# EasyEDA Pro project GPSclock.eprj

# Schematic gpsclock
Create Date: 2023-04-23; Page Name: P1; Project Name: GPSclock; Schematic Name: gpsclock; Update Date: 2023-05-05; Company: EasyEDA.com; Drawed: EasyEDA Pro; Page Size: A4; Part Number: JLCPCB-002; Reviewed: EasyEDA Pro; Version: V0.1
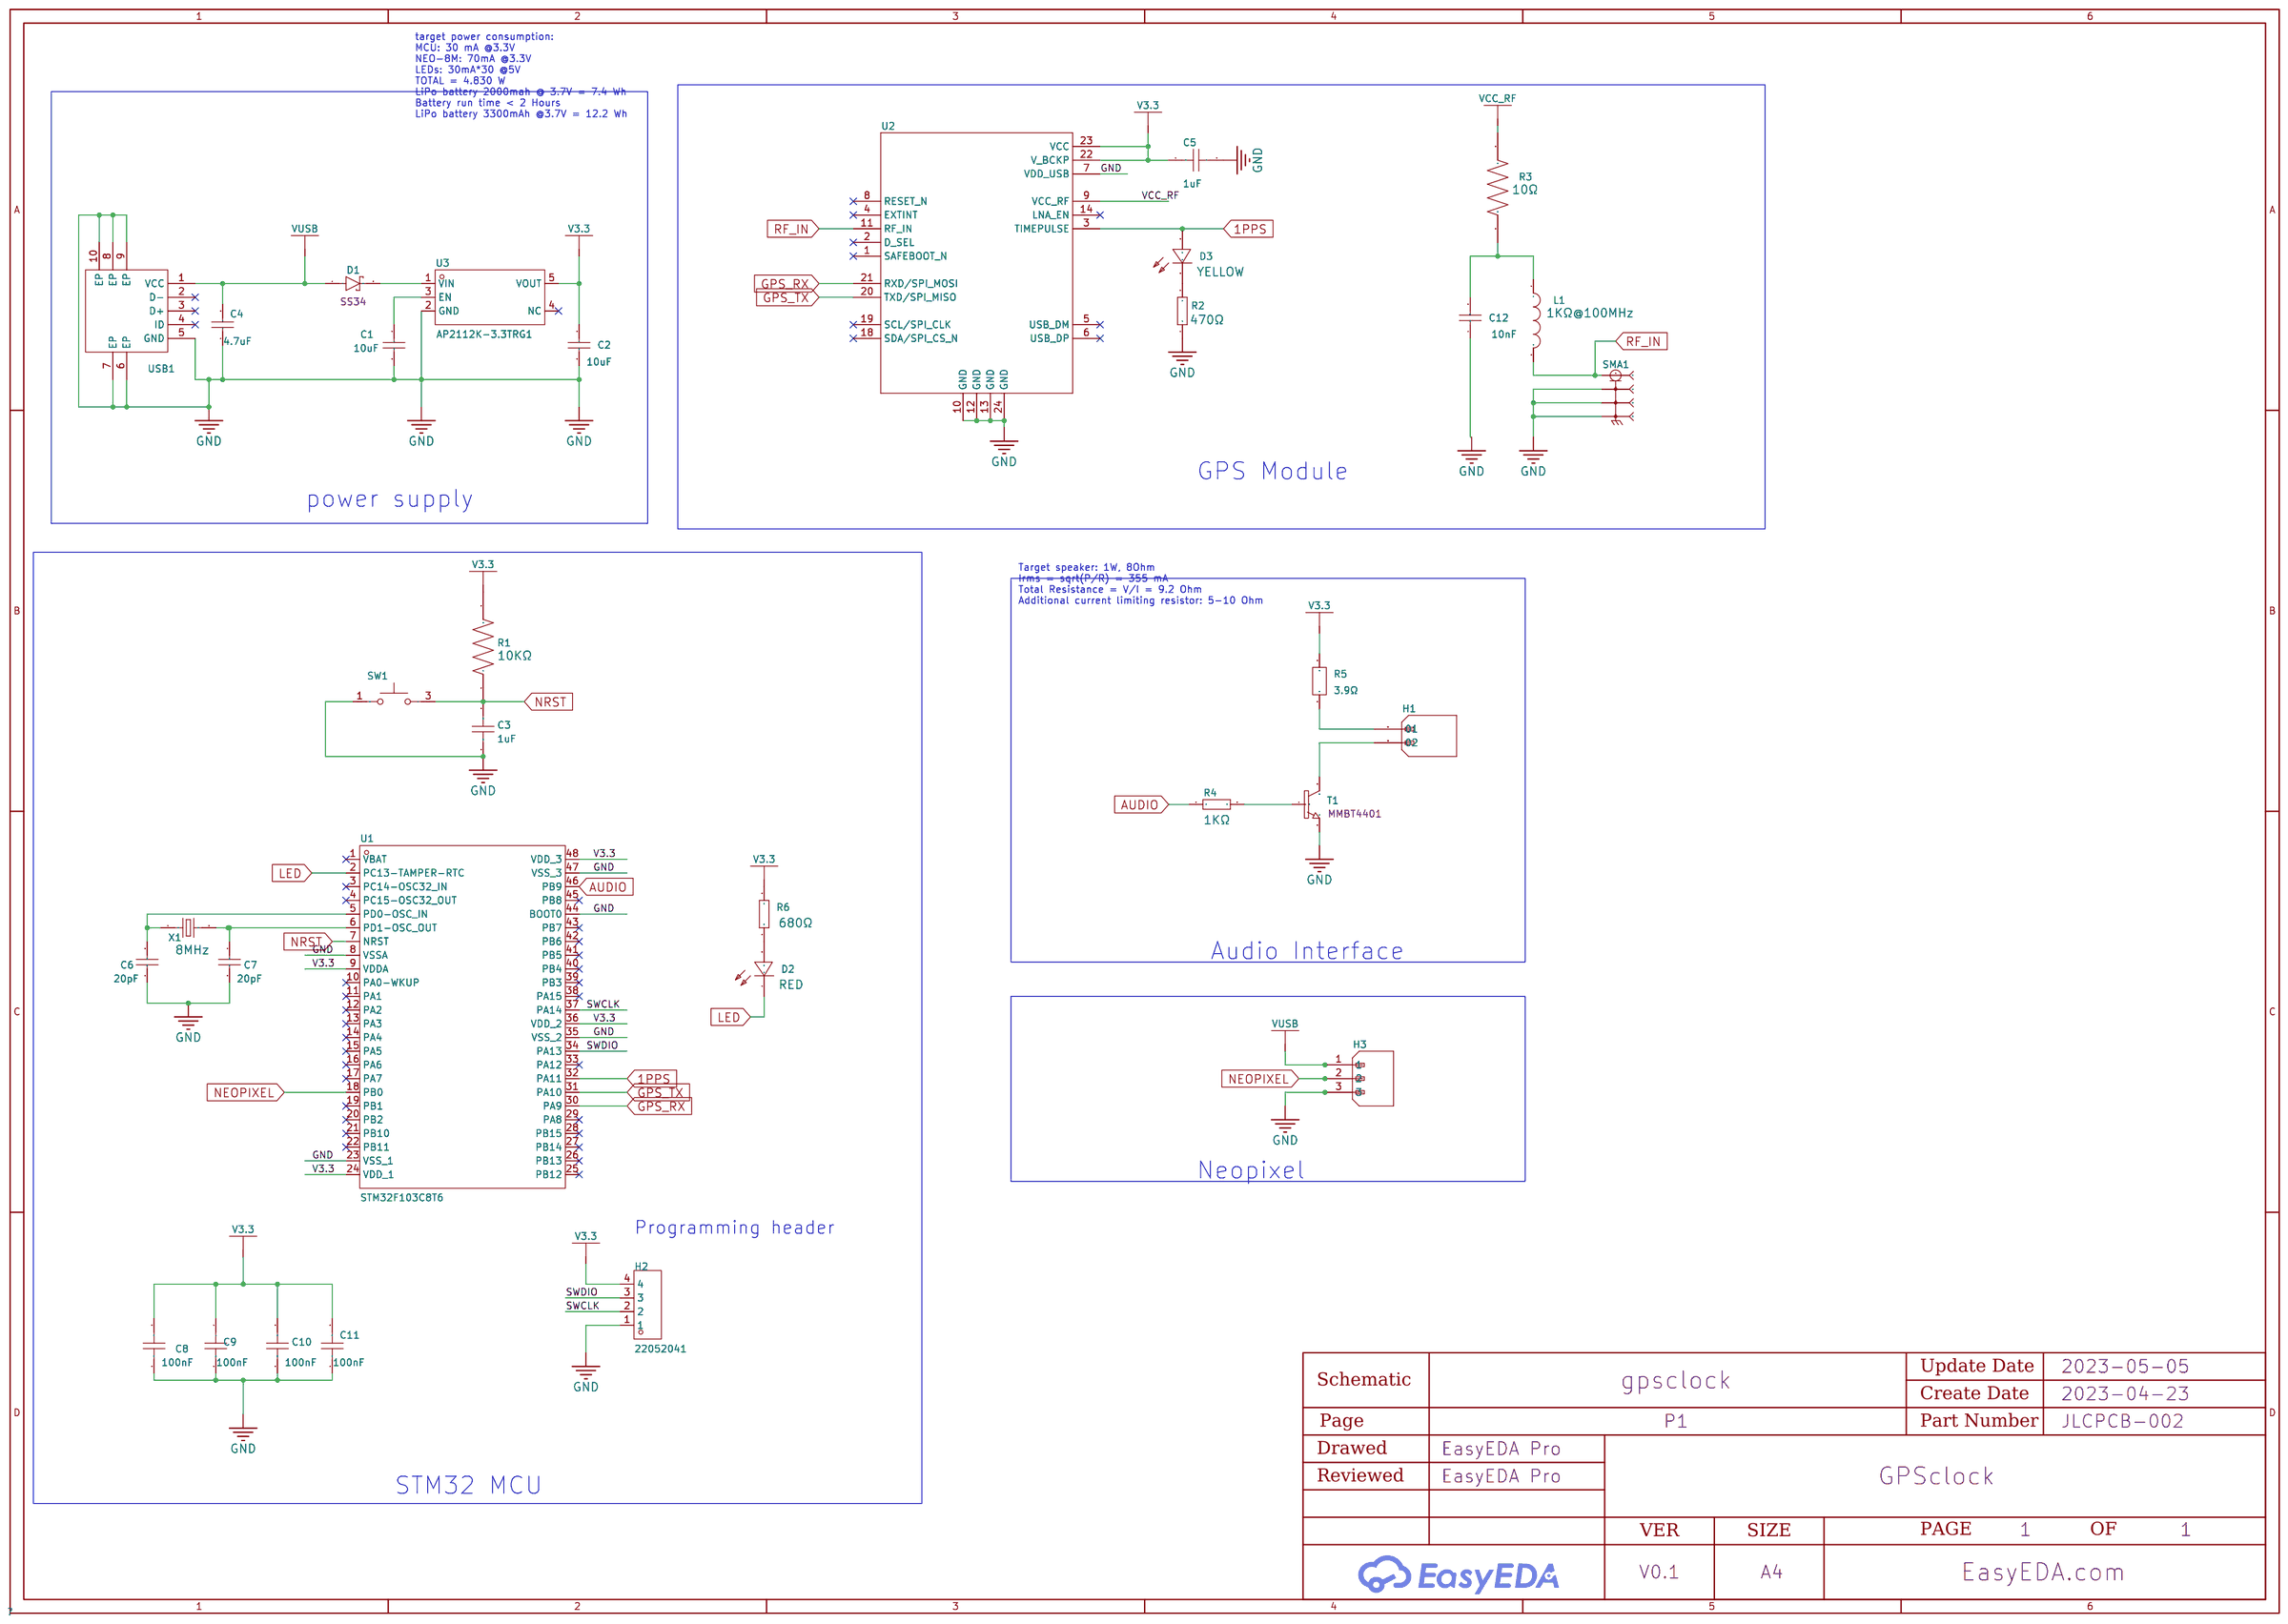
[diagram p0: schematic sheet]

## Parts
C1  10uF  [C1206]
C2  10uF  [C1206]
C3  1uF  [C1206]
C4  4.7uF  [C0603]
C5  1uF  [C1206]
C6  20pF  [C0603]
C7  20pF  [C0603]
C8  100nF  [C0603]
C9  100nF  [C0603]
C10  100nF  [C0603]
C11  100nF  [C0603]
C12  10nF  [C0805]
D1  -  [SODFL3718X102N]
D2  RED  [LED_APHD1608LVBC/D]
D3  YELLOW  [LED_APHD1608LVBC/D]
H1  -  [WURTH_61300211121]
H2  22052041  [HDR-TH_4P-P2.54-H-M-W9.5]
H3  -  [AMPHENOL_G800W305018EU]
L1  1KΩ@100MHz  [BEADC1005X55N]
R1  10KΩ  [RES_ERA8AEB103V]
R2  470Ω  [R0603_NEW]
R3  10Ω  [RESC2012X60N]
R4  1KΩ  [R0603_NEW]
R5  3.9Ω  [RES-TH_BD4.5-L11.5-P15.50-D0.8]
R6  680Ω  [R0603_NEW]
SMA1  -  [MOLEX_0734120110]
SW1  -  [SW_800SP9B6M6RE]
T1  -  [TRANS_MMBT4401]
U1  STM32F103C8T6  [LQFP-48_L7.0-W7.0-P0.50-LS9.0-BL]
U2  -  [XCVR_NEO-M8N-0]
U3  AP2112K-3.3TRG1  [SOT-25-5_L2.9-W1.6-P0.95-LS2.8-BL]
USB1  1050170001  [MICRO-USB-SMD_105017-0001]
X1  8MHz  [XTAL_ECS-80-18-5PX-TR]

## Library data of the parts
C1 C2 = CL31A106KBHNNNE: Capacitance: Tolerance:±10% Tolerance:±10% Voltage Rated: Temperature Coefficient:; LCSC Part Name: 10uF ±10% 50V; Supplier Part: C13585; Manufacturer: SAMSUNG(三星); Supplier Footprint: 1206; JLCPCB Part Class: Basic Part; Datasheet: https://atta.szlcsc.com/upload/public/pdf/source/20160103/1457707668742.pdf; Supplier: LCSC; Tolerance: ±10%
C3 C5 = CL31B105KBHNNNE: Capacitance: Tolerance:±10% Tolerance:±10% Voltage Rated: Temperature Coefficient:; LCSC Part Name: 1uF ±10% 50V; Supplier Part: C1848; Manufacturer: SAMSUNG(三星); Supplier Footprint: 1206; JLCPCB Part Class: Basic Part; Datasheet: https://atta.szlcsc.com/upload/public/pdf/source/20160103/1457707700211.pdf; Supplier: LCSC; Tolerance: ±10%
C4 = CL10A475KO8NNNC: Capacitance: Tolerance:±10% Tolerance:±10% Voltage Rated: Temperature Coefficient:; LCSC Part Name: 4.7uF ±10% 16V; Supplier Part: C19666; Manufacturer: SAMSUNG(三星); Supplier Footprint: 0603; JLCPCB Part Class: Basic Part; Datasheet: https://atta.szlcsc.com/upload/public/pdf/source/20160103/1457707703134.pdf; Supplier: LCSC; Tolerance: ±10%
C6 C7 = CL10C200JB8NNNC: Capacitance: Tolerance:±5% Tolerance:±5% Voltage Rated: Temperature Coefficient:; LCSC Part Name: 20pF ±5% 50V; Supplier Part: C1648; Manufacturer: SAMSUNG(三星); Supplier Footprint: 0603; JLCPCB Part Class: Basic Part; Datasheet: https://atta.szlcsc.com/upload/public/pdf/source/20160103/1457707686863.pdf; Supplier: LCSC; Tolerance: ±5%
C8-C11 = CC0603KRX7R9BB104: Capacitance: Tolerance:±10% Tolerance:±10% Voltage Rated: Temperature Coefficient:; LCSC Part Name: 100nF ±10% 50V; Supplier Part: C14663; Manufacturer: YAGEO(国巨); Supplier Footprint: 0603; JLCPCB Part Class: Basic Part; Datasheet: https://atta.szlcsc.com/upload/public/pdf/source/20180910/C282072_33301C7F631E79921B82A8DAC6BCC5B3.pdf; Supplier: LCSC; Tolerance: ±10%
C12 = CL21B103KBANNNC: Capacitance: Tolerance:±10% Tolerance:±10% Voltage Rated: Temperature Coefficient:; LCSC Part Name: 10nF ±10% 50V; Supplier Part: C1710; Manufacturer: SAMSUNG(三星); Supplier Footprint: 0805; JLCPCB Part Class: Basic Part; Datasheet: https://atta.szlcsc.com/upload/public/pdf/source/20160103/1457707693082.pdf; Supplier: LCSC; Tolerance: ±10%
D1 = SS34LWH_: SS34; Manufacturer: Taiwan Semiconductor Corporation; Manufacturer Part: SS34LWH
D2 = APTD1608LSURCK: Manufacturer: Kingbright
D3 = APTD1608LSYCK: Manufacturer: Kingbright
H1 = 61300211121_: Manufacturer: Würth Elektronik; Manufacturer Part: 61300211121
H2 = 22052041: Pitch:2.54mm Number of Pins:4 Number of Rows: Pin Structure:1x4P Row Spacing:- Mounting Type:Shrouded Circluar Pins/Square Pins:- Current Rating (Max):- Voltage Rating (Max):- Length of Mating Pin:3.15mm Insulation Height:3.3mm Length of End Connection Pi; LCSC Part Name: 2.54mm 1x4P 弯插; Supplier Part: C586987; Manufacturer: MOLEX; Supplier Footprint: 弯插,P=2.54mm; JLCPCB Part Class: Extended Part; Datasheet: https://atta.szlcsc.com/upload/public/pdf/source/20200716/C586991_D4DD4C3D7A2E61AF64D6B99FD6AF9B0B.pdf; Supplier: LCSC; Pitch: 2.54mm; Number of Pins: 4; Pin Structure: 1x4P; Mounting Type: Shrouded; Length of Mating Pin: 3.15mm; Insulation Height: 3.3mm
H3 = G800W305018EU_: Manufacturer: AMPHENOL; Manufacturer Part: G800W305018EU
L1 = BLM15HG102BH1D_: Manufacturer: Murata Electronics; Manufacturer Part: BLM15HG102BH1D
R1 = ERA8AEB103V_
R2 = RC0603FR-13470RL_: Manufacturer: YAGEO; Manufacturer Part: RC0603FR-13470RL
R3 = SR0805FR-4710RL_: Manufacturer: YAGEO; Manufacturer Part: SR0805FR-4710RL
R4 = RC0603FR-101KL_: Manufacturer: YAGEO; Manufacturer Part: RC0603FR-101KL
R5 = RSF100JR-73-3R9: Type:Metal Oxide Resistors Resistance: Tolerance:±5% Tolerance:±5% Power(Watts):1W Temperature Coefficient: Temperature Coefficient: Operating Temperature Range:-55℃~+235℃ Operating Temperature Range:-55℃~+235℃; LCSC Part Name: 3.9Ω ±5% 1W; Supplier Part: C1761372; Manufacturer: YAGEO(国巨); Supplier Footprint: 轴向引线,4.5x11.5mm; JLCPCB Part Class: Extended Part; Datasheet: https://atta.szlcsc.com/upload/public/pdf/source/20200722/C705062_59B157870D59CA0881ABA296A8644ADF.pdf; Supplier: LCSC; Type: Metal Oxide Resistors; Tolerance: ±5%; Power(Watts): 1W; Operating Temperature Range: -55℃~+235℃
R6 = RC0603FR-13680RL_: Manufacturer: YAGEO; Manufacturer Part: RC0603FR-13680RL
SMA1 = 0734120110_: Manufacturer: MOLEX; Manufacturer Part: 0734120110
SW1 = 800SP9B6M6RE_: Manufacturer: E-Switch; Manufacturer Part: 800SP9B6M6RE
T1 = MMBT4401_: MMBT4401; Manufacturer: ANBON SEMICONDUCTOR LIMITED; Manufacturer Part: 4530-MMBT4401CT-ND
U1 = STM32F103C8T6: CPU Core:ARM Cortex-M3 CPU Maximum Speed:72MHz Operating Voltage Range:2V~3.6V Operating Voltage Range:2V~3.6V Program Storage Size:64KB Program Memory Type:FLASH RAM Size:20KB EEPROM:64KB GPIO Ports Number:37 ADC (Bit):12bit DAC (Bit):- PWM (Bit):- Unive; LCSC Part Name: ARM Cortex-M3 72MHz MSL=3; Supplier Part: C8734; Manufacturer: ST(意法半导体); Supplier Footprint: LQFP-48(7x7); JLCPCB Part Class: Basic Part; Datasheet: https://atta.szlcsc.com/upload/public/pdf/source/20220812/8363ACEC51AD55ECEB84799464F7CB85.pdf; Supplier: LCSC; CPU Core: ARM Cortex-M3; CPU Maximum Speed: 72MHz; Operating Voltage Range: 2V~3.6V; Program Storage Size: 64KB; Program Memory Type: FLASH; RAM Size: 20KB; EEPROM: 64KB; GPIO Ports Number: 37; ADC (Bit): 12bit; Peripheral/Function: WDT；DMA；WDT；On-chip temperature sensor; Internal Oscillator: 有; Operating Temperature Range: -40℃~+85℃
U2 = NEO-M8N-0_: Manufacturer: U-BLOX; Manufacturer Part: NEO-M8N-0
U3 = AP2112K-3.3TRG1: Output Type: Output Polarity:Positive Number of Outputs:1 Maximum Input Voltage:6V Output Voltage:3.3V~3.3V Output Voltage:3.3V~3.3V Dropout Voltage:400mV@(600mA) Output Current:600mA Power Supply Rejection Ratio (PSRR):65dB@(100Hz,1kHz); Supplier Part: C51118; Manufacturer: DIODES(美台); Supplier Footprint: SOT-25-5; JLCPCB Part Class: Extended Part; Datasheet: https://atta.szlcsc.com/upload/public/pdf/source/20171221/C51118_15138312998391195590.pdf; Supplier: LCSC; Output Polarity: Positive; Number of Outputs: 1; Maximum Input Voltage: 6V; Output Voltage: 3.3V~3.3V; Dropout Voltage: 400mV@(600mA); Output Current: 600mA; Power Supply Rejection Ratio (PSRR): 65dB@(100Hz,1kHz)
USB1 = 1050170001: Connector Type:Micro-B Standard:USB 2.0 Gender:Female Number of Contacts:5 Number of Ports:1 Mounting Style:Surface Mount Current Rating - Power (Max):- Operating Temperature Range:- Operating Temperature Range:-; LCSC Part Name: Micro-B 母座 卧贴; Supplier Part: C136000; Manufacturer: MOLEX; Supplier Footprint: SMD; JLCPCB Part Class: Extended Part; Datasheet: https://atta.szlcsc.com/upload/public/pdf/source/20171113/C136000_15105610884381115465.pdf; Supplier: LCSC; Connector Type: Micro-B; Standard: USB 2.0; Gender: Female; Number of Contacts: 5; Number of Ports: 1; Mounting Style: Surface Mount
X1 = ECS-80-18-5PX-TR_: Manufacturer: ECS inc; Manufacturer Part: ECS-80-18-5PX-TR

## Nets
GND: C1.1 C2.1 C3.1 C4.1 C5.2 C6.1 C7.2 C8.1 C9.2 C10.1 C11.1 C12.1 H2.1 H3.3 R2.1 SMA1.2(GND) SMA1.3(GND) SMA1.4(GND) SW1.1 T1.2(E) U1.8(VSSA) U1.23(VSS_1) U1.35(VSS_2) U1.44(BOOT0) U1.47(VSS_3) U2.7(VDD_USB) U2.10(GND) U2.12(GND) U2.13(GND) U2.24(GND) U3.2(GND) USB1.5(GND) USB1.6(EP) USB1.7(EP) USB1.8(EP) USB1.9(EP) USB1.10(EP)
V3.3: C2.2 C5.1 C8.2 C9.1 C10.2 C11.2 H2.4 R1.2 R5.2 R6.2 U1.9(VDDA) U1.24(VDD_1) U1.36(VDD_2) U1.48(VDD_3) U2.22(V_BCKP) U2.23(VCC) U3.5(VOUT)
VCC_RF: R3.2 U2.9(VCC_RF)
1PPS: D3.2 U1.32(PA11) U2.3(TIMEPULSE)
AUDIO: R4.1 U1.46(PB9)
GPS_RX: U1.30(PA9) U2.21(RXD/SPI_MOSI)
GPS_TX: U1.31(PA10) U2.20(TXD/SPI_MISO)
LED: D2.1 U1.2(PC13-TAMPER-RTC)
NEOPIXEL: H3.2 U1.18(PB0)
NRST: C3.2 R1.1 SW1.3 U1.7(NRST)
RF_IN: L1.2 SMA1.1(SIG) U2.11(RF_IN)
SWCLK: H2.2 U1.37(PA14)
SWDIO: H2.3 U1.34(PA13)
VUSB: C4.2 D1.A H3.1 USB1.1(VCC)
$1N6146: D1.C(K) U3.1(VIN)
$1N6523: C1.2 U3.3(EN)
$1N16317: C6.2 U1.5(PD0-OSC_IN) X1.1
$1N16353: C7.1 U1.6(PD1-OSC_OUT) X1.2
$1N29102: C12.2 L1.1 R3.1
$1N32351: R4.2 T1.1(B)
$1N32487: H1.01 R5.1
$1N32935: H1.02 T1.3(C)
$1N45748: D2.2 R6.1
$1N45978: D3.1 R2.2

Not connected (* = marked no-connect by the designer): U1 1(VBAT)* 3(PC14-OSC32_IN)* 4(PC15-OSC32_OUT)* 10(PA0-WKUP)* 11(PA1)* 12(PA2)* 13(PA3)* 14(PA4)* 15(PA5)* 16(PA6)* 17(PA7)* 19(PB1)* 20(PB2)* 21(PB10)* 22(PB11)* 25(PB12)* 26(PB13)* 27(PB14)* 28(PB15)* 29(PA8)* 33(PA12)* 38(PA15)* 39(PB3)* 40(PB4)* 41(PB5)* 42(PB6)* 43(PB7)* 45(PB8)*; U2 1(SAFEBOOT_N)* 2(D_SEL)* 4(EXTINT)* 5(USB_DM)* 6(USB_DP)* 8(RESET_N)* 14(LNA_EN)* 18(SDA/SPI_CS_N)* 19(SCL/SPI_CLK)*; U3 4(NC)*; USB1 2(D-)* 3(D+)* 4(ID)*

## Notes on the sheet
- target power consumption:
  MCU: 30 mA @3.3V
  NEO-8M: 70mA @3.3V
  LEDs: 30mA*30 @5V
  TOTAL = 4.830 W
  LiPo battery 2000mah @ 3.7V = 7.4 Wh
  Battery run time < 2 Hours
  LiPo battery 3300mAh @3.7V = 12.2 Wh
- GPS Module
- power supply
- Target speaker: 1W, 8Ohm
  Irms = sqrt(P/R) = 355 mA
  Total Resistance = V/I = 9.2 Ohm
  Additional current limiting resistor: 5-10 Ohm
- Audio Interface
- Neopixel
- Programming header
- STM32 MCU

# Board PCB1
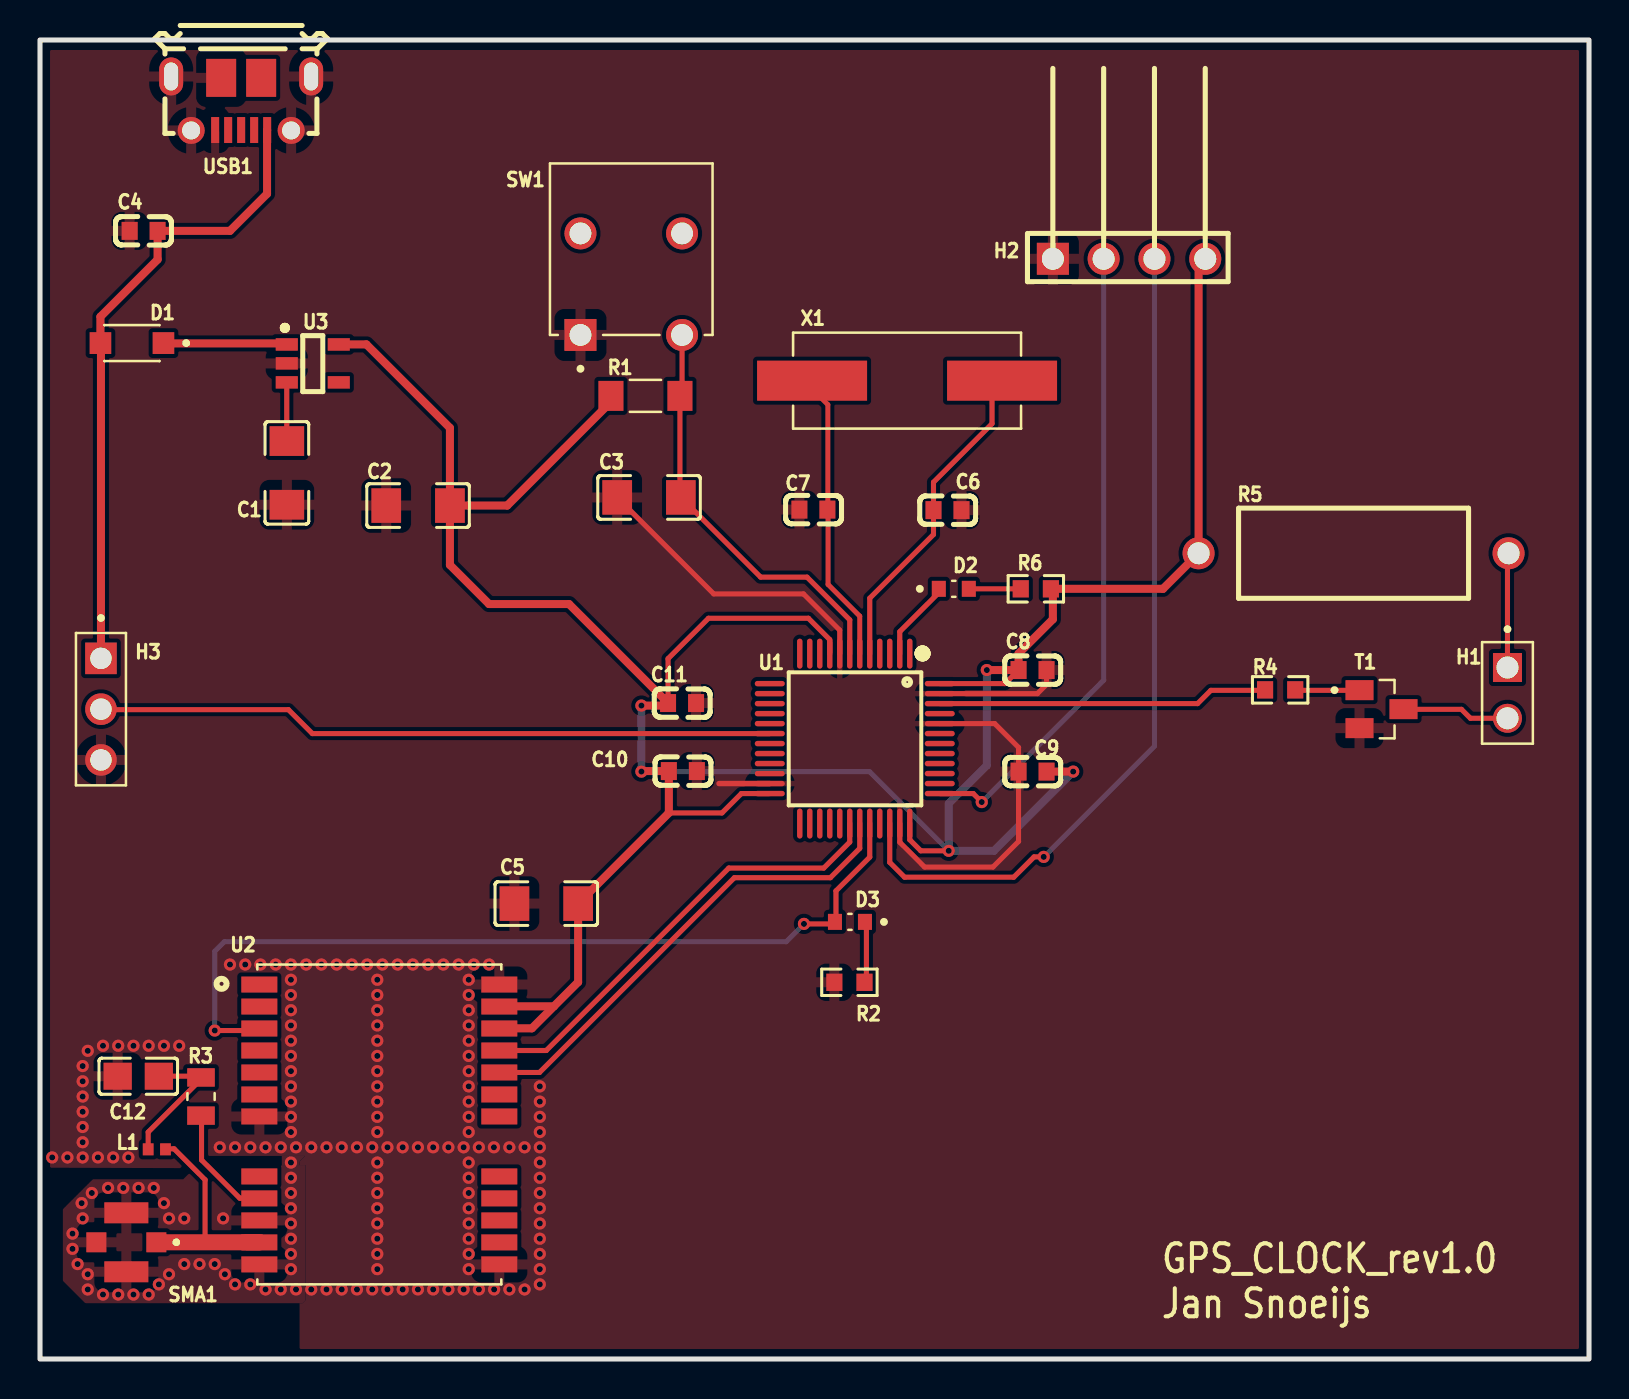
[diagram p1: board, top side]
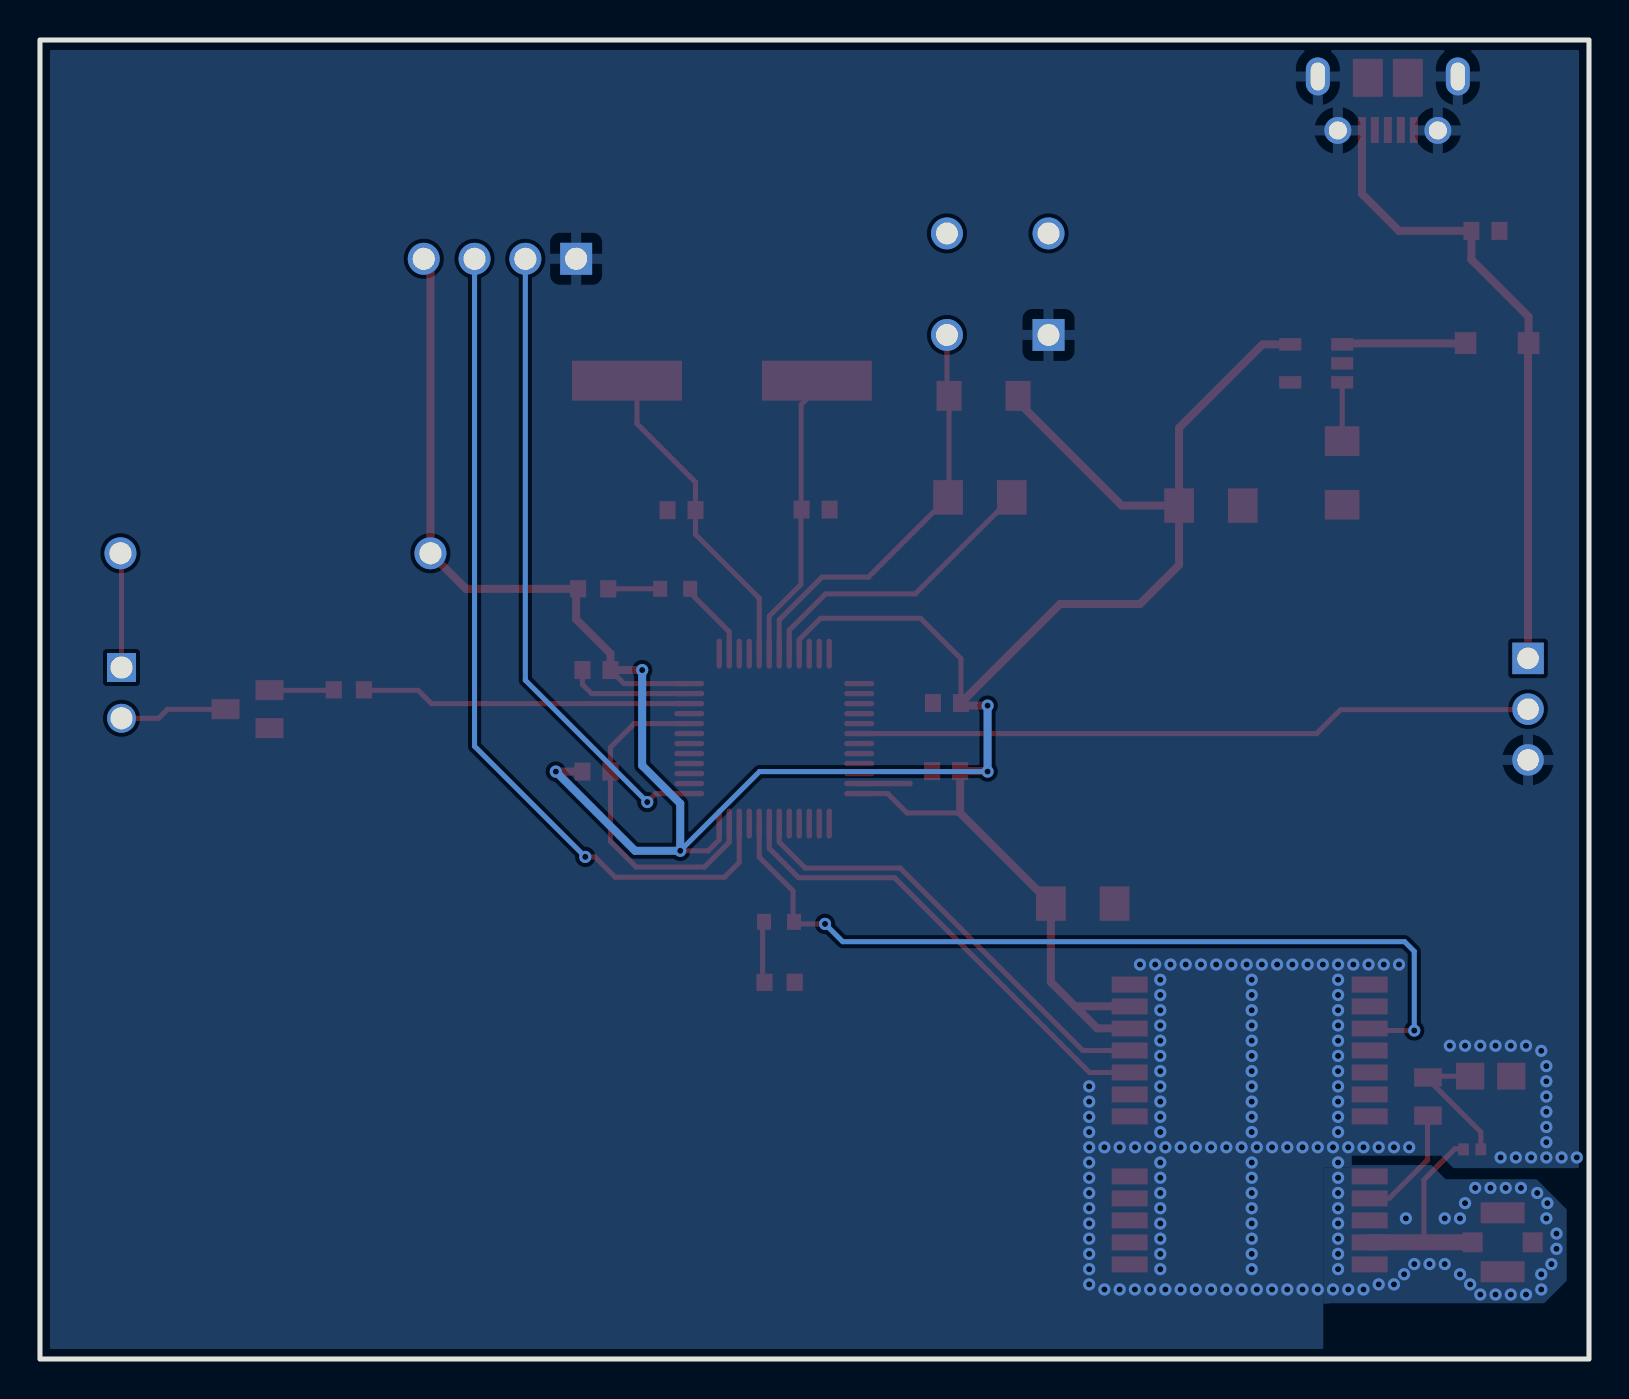
[diagram p2: board, bottom side, seen from below]

Outline 77.46 x 65.99 mm; copper layers: Top Layer, Bottom Layer. Coordinates in mm from the lower left corner of the outline.
Outline path: rectangle 0,65.99 77.46,0
Stack: Top Layer 0.035mm / Dielectric1 1.51mm FR4 er 4.5 / Bottom Layer 0.035mm

## Design rules (mm)
spacing safeClearance (default): track to track 0.152, other pairs 0.152 to 0.3
track width trackWidth (default): min 0.127, default 0.254, max 2.54
differential pair differentialPair (default): width min 0.127, default 0.254, max 2.54; gap min 0.152, default 0.152
via viaSize (default): diameter min 0.5, default 0.61, max 10; hole min 0.3, default 0.305, max 6

## Placement (name value [footprint] x y rotation side)
C1  10uF  [C1206]  12.34 44.33 90 top
C2  10uF  [C1206]  18.9 42.7 0 top
C3  1uF  [C1206]  30.45 43.1 0 top
C4  4.7uF  [C0603]  5.18 56.44 0 top
C5  1uF  [C1206]  25.32 22.78 180 top
C6  20pF  [C0603]  45.38 42.47 180 top
C7  20pF  [C0603]  38.67 42.49 180 top
C8  100nF  [C0603]  49.63 34.47 180 top
C9  100nF  [C0603]  49.63 29.39 180 top
C10  100nF  [C0603]  32.14 29.41 180 top
C11  100nF  [C0603]  32.11 32.82 180 top
C12  10nF  [C0805]  4.91 14.15 0 top
D1  -  [SODFL3718X102N]  4.6 50.83 180 top
D2  RED  [LED_APHD1608LVBC/D]  45.69 38.53 0 top
D3  YELLOW  [LED_APHD1608LVBC/D]  40.5 21.87 180 top
H1  -  [WURTH_61300211121]  73.38 33.33 270 top
H2  22052041  [HDR-TH_4P-P2.54-H-M-W9.5]  54.46 55.04 0 top
H3  -  [AMPHENOL_G800W305018EU]  3.05 32.51 270 top
L1  1KΩ@100MHz  [BEADC1005X55N]  5.84 10.49 0 top
R1  10KΩ  [RES_ERA8AEB103V]  30.27 48.18 180 top
R2  470Ω  [R0603_NEW]  40.47 18.85 0 top
R3  10Ω  [RESC2012X60N]  8.05 13.13 270 top
R4  1KΩ  [R0603_NEW]  62.01 33.48 0 top
R5  3.9Ω  [RES-TH_BD4.5-L11.5-P15.50-D0.8]  65.68 40.31 180 top
R6  680Ω  [R0603_NEW]  49.8 38.53 0 top
SMA1  -  [MOLEX_0734120110]  4.32 5.84 90 top
SW1  -  [SW_800SP9B6M6RE]  29.57 53.77 180 top
T1  -  [TRANS_MMBT4401]  67.08 32.51 0 top
U1  STM32F103C8T6  [LQFP-48_L7.0-W7.0-P0.50-LS9.0-BL]  40.74 31.04 180 top
U2  -  [XCVR_NEO-M8N-0]  16.97 11.74 0 top
U3  AP2112K-3.3TRG1  [SOT-25-5_L2.9-W1.6-P0.95-LS2.8-BL]  13.64 49.81 270 top
USB1  1050170001  [MICRO-USB-SMD_105017-0001]  10.06 62.81 180 top
X1  8MHz  [XTAL_ECS-80-18-5PX-TR]  43.36 48.95 180 top

## Footprints (pads in the part's own frame, mm; a bottom-side part is the same pattern mirrored in y, then rotated)
AMPHENOL_G800W305018EU
  rect 1.578x1.578 hole 1.07: 1(-2.54,0)
  round 1.578 hole 1.07: 2(0,0) 3(2.54,0)
BEADC1005X55N
  rect 0.54x0.6 smd: 1(-0.432,0) 2(0.432,0)
C0603
  rect 0.8x0.9 smd: 1(-0.7,0) 2(0.7,0)
C0805
  rect 1.41x1.35 smd: 1(-1.03,0) 2(1.03,0)
C1206
  rect 1.485x1.728 smd: 1(-1.593,0) 2(1.593,0)
HDR-TH_4P-P2.54-H-M-W9.5
  rect 1.6x1.6 hole 1.1: 1(-3.81,0)
  round 1.6 hole 1.1: 2(-1.27,0) 3(1.27,0) 4(3.81,0)
LED_APHD1608LVBC/D
  rect 0.7x0.8 smd: 1(-0.75,0) 2(0.75,0)
LQFP-48_L7.0-W7.0-P0.50-LS9.0-BL
  oval 0.27x1.5 smd: 1(-2.75,-4.25) 2(-2.25,-4.25) 3(-1.75,-4.25) 4(-1.25,-4.25) 5(-0.75,-4.25) 6(-0.25,-4.25) 7(0.25,-4.25) 8(0.75,-4.25) 9(1.25,-4.25) 10(1.75,-4.25) 11(2.25,-4.25) 12(2.75,-4.25) 25(2.75,4.25) 26(2.25,4.25) 27(1.75,4.25) 28(1.25,4.25) 29(0.75,4.25) 30(0.25,4.25) 31(-0.25,4.25) 32(-0.75,4.25) 33(-1.25,4.25) 34(-1.75,4.25) 35(-2.25,4.25) 36(-2.75,4.25)
  oval 1.5x0.27 smd: 13(4.25,-2.75) 14(4.25,-2.25) 15(4.25,-1.75) 16(4.25,-1.25) 17(4.25,-0.75) 18(4.25,-0.25) 19(4.25,0.25) 20(4.25,0.75) 21(4.25,1.25) 22(4.25,1.75) 23(4.25,2.25) 24(4.25,2.75) 37(-4.25,2.75) 38(-4.25,2.25) 39(-4.25,1.75) 40(-4.25,1.25) 41(-4.25,0.75) 42(-4.25,0.25) 43(-4.25,-0.25) 44(-4.25,-0.75) 45(-4.25,-1.25) 46(-4.25,-1.75) 47(-4.25,-2.25) 48(-4.25,-2.75)
MICRO-USB-SMD_105017-0001
  rect 0.4x1.3 smd: 1(-1.3,1.33) 2(-0.65,1.33) 3(0,1.33) 4(0.65,1.33) 5(1.3,1.33)
  round 1.35 hole 0.9: 6(-2.5,1.35) 7(2.5,1.35)
  oval 1.2x1.9 hole 0.7x1.4: 8(3.5,-1.35) 9(-3.5,-1.35)
  rect 1.5x1.9 smd: 10(-1,-1.28) 10(1,-1.28)
MOLEX_0734120110
  rect 1x1 smd: 1(0,-1.5) 3(0,1.5)
  rect 1.05x2.2 smd: 2(-1.475,0) 4(1.475,0)
R0603_NEW
  rect 0.806x0.864 smd: 1(-0.753,0) 2(0.753,0)
RES-TH_BD4.5-L11.5-P15.50-D0.8
  round 1.6 hole 1.1: 1(-7.75,0) 2(7.75,0)
RES_ERA8AEB103V
  rect 1.25x1.5 smd: 1(-1.725,0) 2(1.725,0)
RESC2012X60N
  rect 0.92x1.38 smd: 1(-0.955,0) 2(0.955,0)
SODFL3718X102N
  rect 1.08x1.09 smd: A(1.575,0) C(-1.575,0)
SOT-25-5_L2.9-W1.6-P0.95-LS2.8-BL
  rect 0.623x1.105 smd: 1(-0.95,-1.3) 2(-0.001,-1.3) 3(0.95,-1.3) 4(0.95,1.3) 5(-0.95,1.3)
SW_800SP9B6M6RE
  rect 1.598x1.598 hole 1.09: 1(2.54,2.54)
  round 1.598 hole 1.09: 3(-2.54,2.54) S1(2.54,-2.54) S2(-2.54,-2.54)
TRANS_MMBT4401
  rect 1.4x1 smd: 1(-1.1,0.95) 2(-1.1,-0.95) 3(1.1,0)
WURTH_61300211121
  rect 1.45x1.45 hole 1.1: 01(-1.27,0)
  round 1.45 hole 1.1: 02(1.27,0)
XCVR_NEO-M8N-0
  rect 1.8x0.8 smd: 1(-6,7) 2(-6,5.9) 3(-6,4.8) 4(-6,3.7) 5(-6,2.6) 6(-6,1.5) 7(-6,0.4) 8(-6,-2.6) 9(-6,-3.7) 10(-6,-4.8) 11(-6,-5.9) 12(-6,-7) 13(6,-7) 14(6,-5.9) 15(6,-4.8) 16(6,-3.7) 17(6,-2.6) 18(6,0.4) 19(6,1.5) 20(6,2.6) 21(6,3.7) 22(6,4.8) 23(6,5.9) 24(6,7)
XTAL_ECS-80-18-5PX-TR
  rect 5.5x2 smd: 1(-4.75,0) 2(4.75,0)

## Nets
As in the schematic.

Pads without a net: SW1 S1 S2; U1 1 3 4 10 11 12 13 14 15 16 17 19 20 21 22 25 26 27 28 29 33 38 39 40 41 42 43 45; U2 1 2 4 5 6 8 14 15 16 17 18 19; U3 4; USB1 2 3 4

## Via types
v1: diameter 0.61, hole 0.305, Top Layer to Bottom Layer, 184 vias

## Routing (per net, layer and track width the routed paths; a pad name or vN(x,y) marks a point on that pad's centre or on a via; arc(x,y) is an arc through that point)
GND: length 40.9
  Top Layer w0.254: U1.47 49.88,33.29 50.33,33.75 C8.1 ; U1.44 47.74,31.79 48.93,30.6 C9.2 48.93,25.89 47.65,24.61 44.23,24.61 42.99,25.85 U1.35 ; U1.8 39.99,36.46 38.18,38.28 33.69,38.28 C3.1
  Top Layer w0.27: U1.23 33.95,28.79
  vias: v1(0.61,10.08) v1(1.37,10.08) v1(1.63,6.27) v1(1.63,5.51) v1(1.88,4.75) v1(2.08,7.8) v1(2.13,14.66) v1(2.13,13.89) v1(2.13,13.13) v1(2.13,12.37) v1(2.13,11.61) v1(2.13,10.85) v1(2.13,10.08) v1(2.13,7.04) v1(2.39,15.42) v1(2.39,4.24) v1(2.39,3.48) v1(2.59,8.31) v1(2.9,10.08) v1(3.15,15.67) v1(3.15,3.23) v1(3.4,8.56) v1(3.66,10.08) v1(3.91,15.67) v1(3.91,3.23) v1(4.17,8.56) v1(4.42,10.08) v1(4.67,15.67) v1(4.67,3.23) v1(4.93,8.56) v1(5.44,15.67) v1(5.44,3.23) v1(5.69,8.56) v1(5.94,3.73) v1(6.2,15.67) v1(6.2,7.8) v1(6.45,7.04) v1(6.45,4.24) v1(6.96,15.67) v1(7.21,7.04) v1(7.21,4.75) v1(7.98,4.75) v1(8.74,4.75) v1(8.99,10.59) v1(9.16,7.04) v1(9.25,4.24) v1(9.5,19.74) v1(9.75,10.59) v1(9.75,3.73) v1(10.26,19.74) v1(10.52,10.59) v1(10.52,3.73) v1(11.02,19.74) v1(11.28,10.59) v1(11.28,3.48) v1(11.79,19.74) v1(12.04,10.59) v1(12.04,3.48) v1(12.55,19.74) v1(12.55,18.97) v1(12.55,18.21) v1(12.55,17.45) v1(12.55,16.69) v1(12.55,15.93) v1(12.55,15.16) v1(12.55,14.4) v1(12.55,13.64) v1(12.55,12.88) v1(12.55,12.12) v1(12.55,11.35) v1(12.55,9.83) v1(12.55,9.07) v1(12.55,8.31) v1(12.55,7.54) v1(12.55,6.78) v1(12.55,6.02) v1(12.55,5.26) v1(12.55,4.5) v1(12.8,10.59) v1(12.8,3.48) v1(13.31,19.74) v1(13.56,10.59) v1(13.56,3.48) v1(14.07,19.74) v1(14.33,10.59) v1(14.33,3.48) v1(14.83,19.74) v1(15.09,10.59) v1(15.09,3.48) v1(15.6,19.74) v1(15.85,10.59) v1(15.85,3.48) v1(16.36,19.74) v1(16.61,10.59) v1(16.61,3.48) v1(16.87,18.97) v1(16.87,18.21) v1(16.87,17.45) v1(16.87,16.69) v1(16.87,15.93) v1(16.87,15.16) v1(16.87,14.4) v1(16.87,13.64) v1(16.87,12.88) v1(16.87,12.12) v1(16.87,11.35) v1(16.87,9.83) v1(16.87,9.07) v1(16.87,8.31) v1(16.87,7.54) v1(16.87,6.78) v1(16.87,6.02) v1(16.87,5.26) v1(16.87,4.5) v1(17.12,19.74) v1(17.37,10.59) v1(17.37,3.48) v1(17.88,19.74) v1(18.14,10.59) v1(18.14,3.48) v1(18.64,19.74) v1(18.9,10.59) v1(18.9,3.48) v1(19.41,19.74) v1(19.66,10.59) v1(19.66,3.48) v1(20.17,19.74) v1(20.42,10.59) v1(20.42,3.48) v1(20.93,19.74) v1(21.18,10.59) v1(21.18,3.48) v1(21.44,18.97) v1(21.44,18.21) v1(21.44,17.45) v1(21.44,16.69) v1(21.44,15.93) v1(21.44,15.16) v1(21.44,14.4) v1(21.44,13.64) v1(21.44,12.88) v1(21.44,12.12) v1(21.44,11.35) v1(21.44,9.83) v1(21.44,9.07) v1(21.44,8.31) v1(21.44,7.54) v1(21.44,6.78) v1(21.44,6.02) v1(21.44,5.26) v1(21.44,4.5) v1(21.69,19.74) v1(21.95,10.59) v1(21.95,3.48) v1(22.45,19.74) v1(22.7,10.59) v1(22.71,3.48) v1(23.47,10.59) v1(23.47,3.48) v1(24.23,10.59) v1(24.23,3.48) v1(24.99,13.64) v1(24.99,12.88) v1(24.99,12.12) v1(24.99,11.35) v1(24.99,10.59) v1(24.99,9.83) v1(24.99,9.07) v1(24.99,8.31) v1(24.99,7.54) v1(24.99,6.78) v1(24.99,6.02) v1(24.99,5.26) v1(24.99,4.5) v1(24.99,3.73)
V3.3: length 154.7
  Top Layer w0.254: U1.48 48.25,33.79 C8.2 ; v1(45.44,25.43) 44.04,25.43 43.49,25.98 U1.36 ; U1.9 39.49,35.99 38.42,37.06 33.43,37.06 31.41,35.04 C11.2 ; 31.45,27.32 34.1,27.32 35.07,28.29 U1.24
  Top Layer w0.4: v1(30.07,29.39) 30.1,29.41 C10.2 31.45,27.32 C5.1 26.91,18.86 25.7,17.64 ; C2.2 20.5,39.73 22.45,37.77 26.45,37.77 C11.2 31.28,32.69 v1(30.07,32.69) ; C2.2 23.36,42.7 28.55,47.89 R1.2 ; C2.2 20.5,46.58 16.32,50.76 14.94,50.76 ; 23.02,16.54 24.6,16.54 25.7,17.64 ; C9.1 v1(51.66,29.39) ; 25.7,17.64 23.02,17.64 ; H2.4 57.93,54.71 R5.2 56.16,38.53 50.65,38.53 50.65,38.53 50.65,37.01 48.93,35.29 C8.2 v1(47.35,34.47)
  Bottom Layer w0.254: v1(45.44,25.43) 41.48,29.39 v1(30.07,29.39)
  Bottom Layer w0.4: v1(30.07,29.39) v1(30.07,32.69) ; v1(47.35,34.47) 47.35,29.69 45.44,27.79 v1(45.44,25.43) 47.7,25.43 v1(51.66,29.39)
VCC_RF: length 6
  Top Layer w0.254: R3.2 8.08,12.15 8.08,9.96 9.99,8.04 11.02,8.04
1PPS: length 43.6
  Top Layer w0.254: v1(38.2,21.77) 39.65,21.77 39.8,21.92 39.8,23.42 41.49,25.11 U1.32 ; 11.02,16.54 10.91,16.43 v1(8.74,16.43)
  Bottom Layer w0.254: v1(38.2,21.77) 37.31,20.88 9.22,20.88 8.74,20.4 v1(8.74,16.43)
AUDIO: length 16.6
  Top Layer w0.254: U1.46 57.88,32.79 58.55,33.45 61.14,33.45 61.16,33.48 R4.1
GPS_RX: length 22.8
  Top Layer w0.254: U1.30 40.49,25.86 39.19,24.56 34.44,24.56 25.32,15.44 22.97,15.44
GPS_TX: length 23.9
  Top Layer w0.254: U2.20 24.98,14.34 34.72,24.08 39.52,24.08 40.99,25.55 U1.31
LED: length 4.1
  Top Layer w0.254: U1.2 42.99,36.39 44.89,38.29 44.89,38.48 D2.1
NEOPIXEL: length 33.9
  Top Layer w0.254: H3.2 3.07,32.49 12.42,32.49 13.62,31.29 U1.18
NRST: length 20.9
  Top Layer w0.254: SW1.3 32.11,48.29 R1.1 32,43.15 C3.2 36.04,39.12 38.35,39.12 40.49,36.98 U1.7
RF_IN: length 11.6
  Top Layer w0.254: 8.25,5.77 8.25,8.97 6.71,10.52 6.3,10.52 L1.2
  Top Layer w0.8: 5.89,5.84 11,5.84 10.31,5.84
SWCLK: length 32
  Top Layer w0.254: v1(47.09,27.86) 46.67,28.29 U1.37
  Bottom Layer w0.254: H2.2 53.19,33.96 v1(47.09,27.86)
SWDIO: length 42.6
  Top Layer w0.254: v1(50.19,25.12) 49.71,25.12 48.69,24.11 43.23,24.11 42.49,24.84 U1.34
  Bottom Layer w0.254: H2.3 55.73,30.66 v1(50.19,25.12)
VUSB: length 32
  Top Layer w0.4: USB1.1 11.35,61.48 11.35,58.29 9.5,56.44 C4.2 5.88,55.01 3.02,52.15 D1.A 3.05,50.8 H3.1
$1N6146: length 6.2
  Top Layer w0.4: D1.C 6.19,50.81 12.29,50.81 12.34,50.76
$1N6523: length 2.9
  Top Layer w0.254: C1.2 12.34,45.93 U3.3
$1N16317: length 16.4
  Top Layer w0.254: X1.1 47.6,48.44 47.6,46.79 44.68,43.87 C6.2 44.68,41.25 41.49,38.06 U1.5
$1N16353: length 14.6
  Top Layer w0.245: U1.6 40.99,37.16 39.41,38.75 39.41,42.47 39.4,42.48 39.4,47.75 38.61,48.53 X1.2
$1N29102: length 7.1
  Top Layer w0.254: L1.1 5.41,11.35 8.1,14.05 8,14.15 5.83,14.15 5.78,14.1
$1N32351: length 3.4
  Top Layer w0.254: 66.14,33.45 62.89,33.45 62.86,33.48 R4.2
$1N32487: length 5.7
  Top Layer w0.254: R5.1 73.38,40.26 H1.01
$1N32935: length 5.4
  Top Layer w0.254: 68.14,32.5 71.08,32.5 71.53,32.06 H1.02
$1N45748: length 2.5
  Top Layer w0.254: 48.95,38.53 46.5,38.53 46.49,38.54
$1N45978: length 3.1
  Top Layer w0.254: 41.32,18.85 41.32,21.8 D3.1

## Copper pours and planes (outline as drawn; the poured copper is in the pictures)
GND on Top Layer: 13.28,9.7 7.87,9.7 7.16,8.99 2.64,8.99 1.14,7.49 1.14,3.91 2.26,2.79 13.13,2.79 13.28,2.95
GND on Top Layer: 13.26,10.16 7.62,10.16 7.01,9.55 -1.04,9.58 -1.07,67.03 76.96,67.03 77.19,67.26 80.57,67.26 80.59,67.29 80.59,1.22 80.47,-2.34 12.98,-2.03 12.98,9.88
GND on Top Layer: 12.09,10.26 13.34,10.26 13.34,9.4 12.09,9.4
GND on Bottom Layer: 11.81,10.17 7.41,10.17 6.78,9.55 -1.24,9.55 -1.27,9.58 -1.27,67.21 80.14,67.21 80.26,67.34 80.26,-2.16 13.69,-2.16 13.28,-1.75 13.28,9.53 13.23,9.58 11.99,9.58 11.86,9.7 11.86,10.16 11.8,10.16
GND on Bottom Layer: 7.87,9.7 7.16,8.99 2.67,8.99 2.64,9.02 1.12,7.49 1.12,3.91 2.23,2.79 12.98,2.79 13,2.77 13.74,2.77 13.79,1.47 13.79,9.68 13.82,9.7

Small or netless copper shapes (teardrops, artwork), in the pictures only: 2 on Bottom Layer

## Text on the board
Top Silkscreen Layer: GPS_CLOCK_rev1.0 / Jan Snoeijs
